# EAGLE design lcd_octopus_t2313_pwm_contrast (EAGLE 6.1)
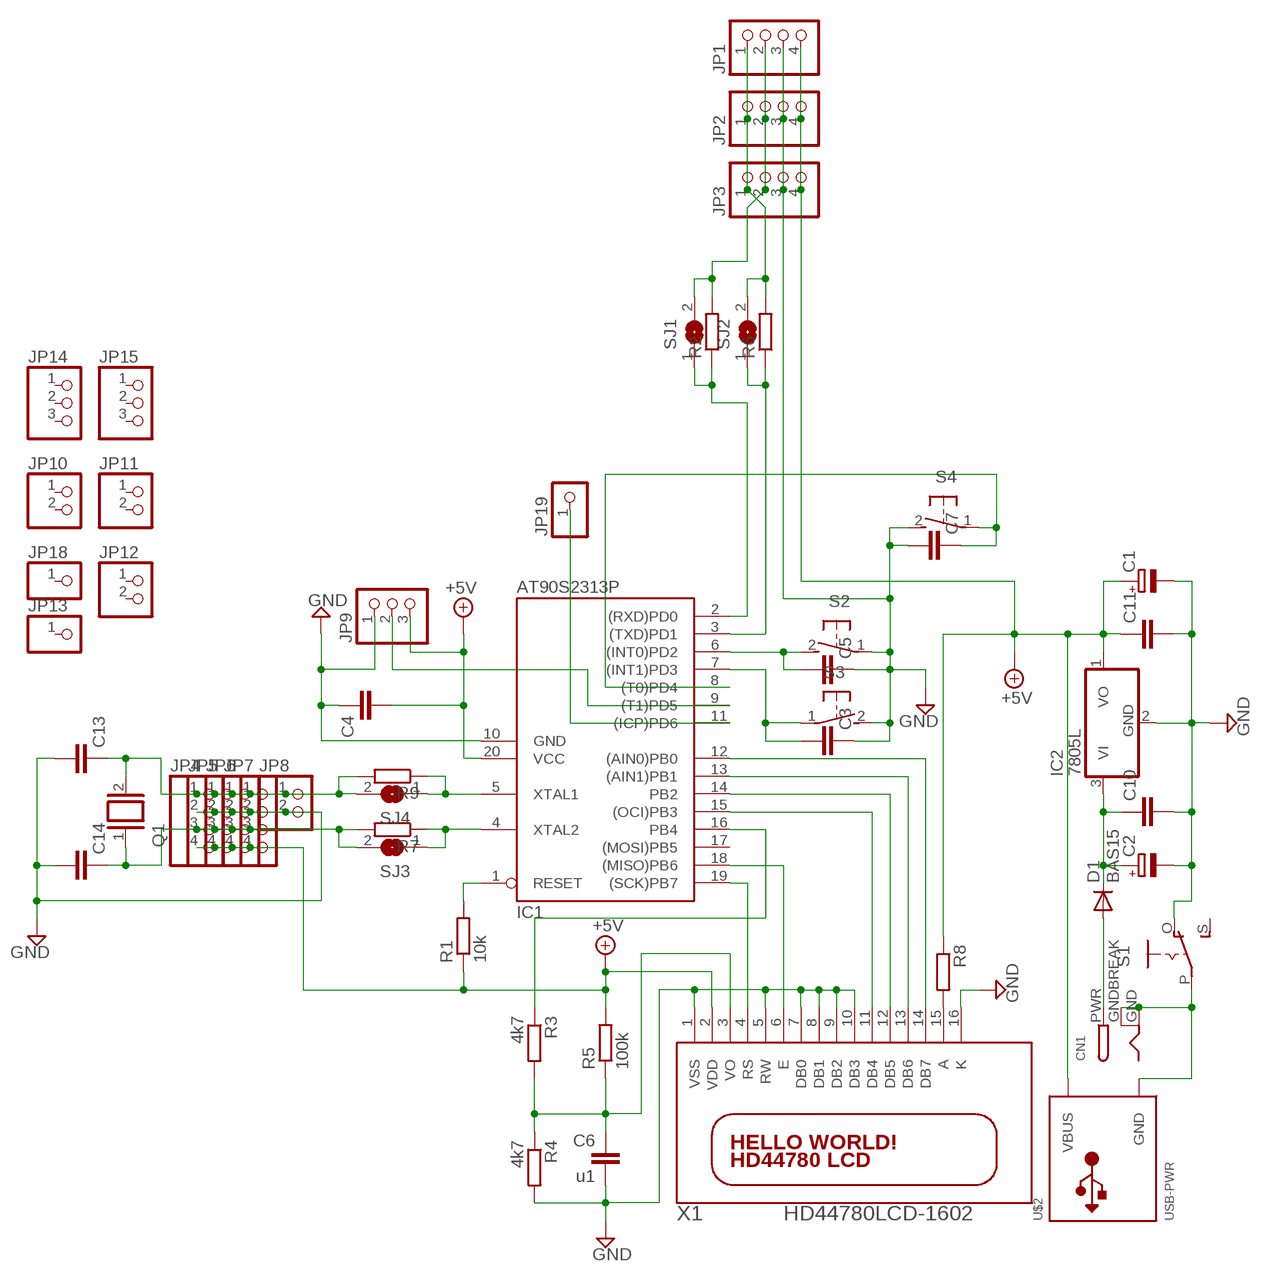
[diagram p0: schematic, sheet 1]

## Parts
C1  CPOL-EUTT2D5L  [TT2D5L]
C2  CPOL-EUTT2D5L  [TT2D5L]
C3  C-EU025-025X050  [C025-025X050]
C4  C-EU025-025X050  [C025-025X050]
C5  C-EU025-025X050  [C025-025X050]
C6  u1  C-EU025-025X050  [C025-025X050]
C7  C-EU025-025X050  [C025-025X050]
C10  C-EU025-025X050  [C025-025X050]
C11  C-EU025-025X050  [C025-025X050]
C13  C-EU025-025X050  [C025-025X050]
C14  C-EU025-025X050  [C025-025X050]
CN1  DCBARRELPTH  [DCJACK_2MM_PTH]
D1  BAS15  [DO34-7]
IC1  AT90S2313P  [DIL20]
IC2  7805L  [TO92]
JP1  PINHD-1X4/90  [1X04/90]
JP2  PINHD-1X4  [1X04]
JP3  PINHD-1X4  [1X04]
JP4  PINHD-1X4  [1X04]
JP5  PINHD-1X4  [1X04]
JP6  PINHD-1X4  [1X04]
JP7  PINHD-1X4  [1X04]
JP8  PINHD-1X2  [1X02]
JP9  PINHD-1X3  [1X03]
JP10  PINHD-1X2  [1X02]
JP11  PINHD-1X2  [1X02]
JP12  PINHD-1X2  [1X02]
JP13  PINHD-1X1  [1X01]
JP14  PINHD-1X3  [1X03]
JP15  PINHD-1X3  [1X03]
JP18  PINHD-1X1  [1X01]
JP19  PINHD-1X1  [1X01]
Q1  XTAL/S  [QS]
R1  10k  R-EU_0204/7  [0204/7]
R2  R-EU_0204/7  [0204/7]
R3  4k7  R-EU_0207/12  [0207/12]
R4  4k7  R-EU_0204/7  [0204/7]
R5  100k  R-EU_0204/7  [0204/7]
R6  R-EU_0204/7  [0204/7]
R7  R-EU_0204/7  [0204/7]
R8  R-EU_0204/7  [0204/7]
R9  R-EU_0204/7  [0204/7]
S1  EG1218S  [EG1218]
S2  31-XX  [B3F-31XX]
S3  31-XX  [B3F-31XX]
S4  31-XX  [B3F-31XX]
SJ1  SJ  [SJ]
SJ2  SJ  [SJ]
SJ3  SJ  [SJ]
SJ4  SJ  [SJ]
U$2  USB-PWR  [USB-MINIB-THM-MOLEX-PWRONLY]
X1  HD44780LCD-1602  [LCD1602]

## Nets
+5V: C1.+ C4.2 C11.1 IC1.20(VCC) IC2.1(VO) JP1.4 JP2.4 JP3.4 JP4.4 JP5.4 JP6.4 JP7.4 JP9.3 R1.1 R5.2 R8.1 U$2.VBUS X1.2(VDD)
EN: IC1.18((MISO)PB6) X1.6(E)
GND: C1.- C2.- C3.1 C4.1 C5.1 C6.2 C7.2 C10.2 C11.2 C13.2 C14.2 IC1.10(GND) IC2.2(GND) JP1.3 JP2.3 JP3.3 JP4.2 JP5.2 JP6.2 JP7.2 JP8.2 JP9.1 R4.2 S1.O S2.1(P) S3.2(S) S4.2(S) X1.1(VSS) X1.5(RW) X1.7(DB0) X1.8(DB1) X1.9(DB2) X1.10(DB3) X1.16(K)
N$1: C2.+ C10.1 D1.C IC2.3(VI)
N$2: IC1.19((SCK)PB7) X1.4(RS)
N$3: IC1.15((OCI)PB3) X1.11(DB4)
N$4: IC1.14(PB2) X1.12(DB5)
N$5: R8.2 X1.15(A)
N$6: IC1.13((AIN1)PB1) X1.13(DB6)
N$7: IC1.12((AIN0)PB0) X1.14(DB7)
N$8: C6.1 R3.2 R4.1 R5.1 X1.3(VO)
N$9: IC1.1(RESET) R1.2
N$10: C3.2 IC1.7((INT1)PD3) S3.1(P)
N$11: IC1.9((T1)PD5) JP9.2
N$12: C5.2 IC1.6((INT0)PD2) S2.2(S)
N$13: C14.1 JP4.3 JP5.3 JP6.3 JP7.3 Q1.1 R7.2 SJ3.2
N$14: CN1.PWR D1.A
N$15: IC1.16(PB4) R3.1
N$16: IC1.3((TXD)PD1) R6.1 SJ2.1
N$17: CN1.GND CN1.GNDBREAK S1.P U$2.GND
N$18: IC1.2((RXD)PD0) R2.1 SJ1.1
N$19: IC1.4(XTAL2) R7.1 SJ3.1
N$20: C7.1 IC1.8((T0)PD4) S4.1(P)
N$21: IC1.11((ICP)PD6) JP19.1
N$22: JP1.2 JP2.2 JP3.2 R2.2 SJ1.2
N$23: JP1.1 JP2.1 JP3.1 R6.2 SJ2.2
N$24: C13.1 JP4.1 JP5.1 JP6.1 JP7.1 JP8.1 Q1.2 R9.2 SJ4.2
N$25: IC1.5(XTAL1) R9.1 SJ4.1
Unconnected: IC1.17((MOSI)PB5) JP10.1 JP10.2 JP11.1 JP11.2 JP12.1 JP12.2 JP13.1 JP14.1 JP14.2 JP14.3 JP15.1 JP15.2 JP15.3 JP18.1 S1.S

## Library data of the parts
C1 C2 = rcl:CPOL-EU: POLARIZED CAPACITOR, European symbol
C3-C7 C10 C11 C13 C14 = rcl:C-EU: CAPACITOR, European symbol
CN1 = adafruit:DCBARREL: 2.0mm DC Barrel Jack DCJACK_2MM_PTH - Through Hole Jack (4UConnector: 05537)
D1 = diode:BAS15: DIODE high speed
IC1 = atmel:AT90S2313: MICROCONTROLLER 2 Kbytes FLASH 128 bytes SRAM 128 bytes EEPROM UART; OC_FARNELL: unknown; OC_NEWARK: unknown
IC2 = linear:78*: Positive VOLTAGE REGULATOR Source: http://cache.national.com/ds/LM/LM78L05.pdf http://www.fairchildsemi.com/ds/LM/LM7805.pdf
JP1-JP7 = pinhead:PINHD-1X4: PIN HEADER
JP8 JP10-JP12 = pinhead:PINHD-1X2: PIN HEADER
JP9 JP14 JP15 = pinhead:PINHD-1X3: PIN HEADER
JP13 JP18 JP19 = pinhead:PINHD-1X1: PIN HEADER
Q1 = special:XTAL/S: CRYSTAL
R1-R9 = rcl:R-EU_: RESISTOR, European symbol
S1 = adafruit:EG1218: SLIDING SWITCH 0.1" spacing through hole, vertical SPDT slide switch http://www.ladyada.net/library/pcb/eaglelibrary.html
S2-S4 = adafruit:31-XX: OMRON SWITCH Now with beefier pads!
SJ1-SJ4 = jumper:SJ: SMD solder JUMPER
U$2 = adafruit:USB-PWR
X1 = adafruit:HD44780LCD: HD44780 LCD Standard character type LCDs, available in sizes from 8x1 to 40x4!

## Board
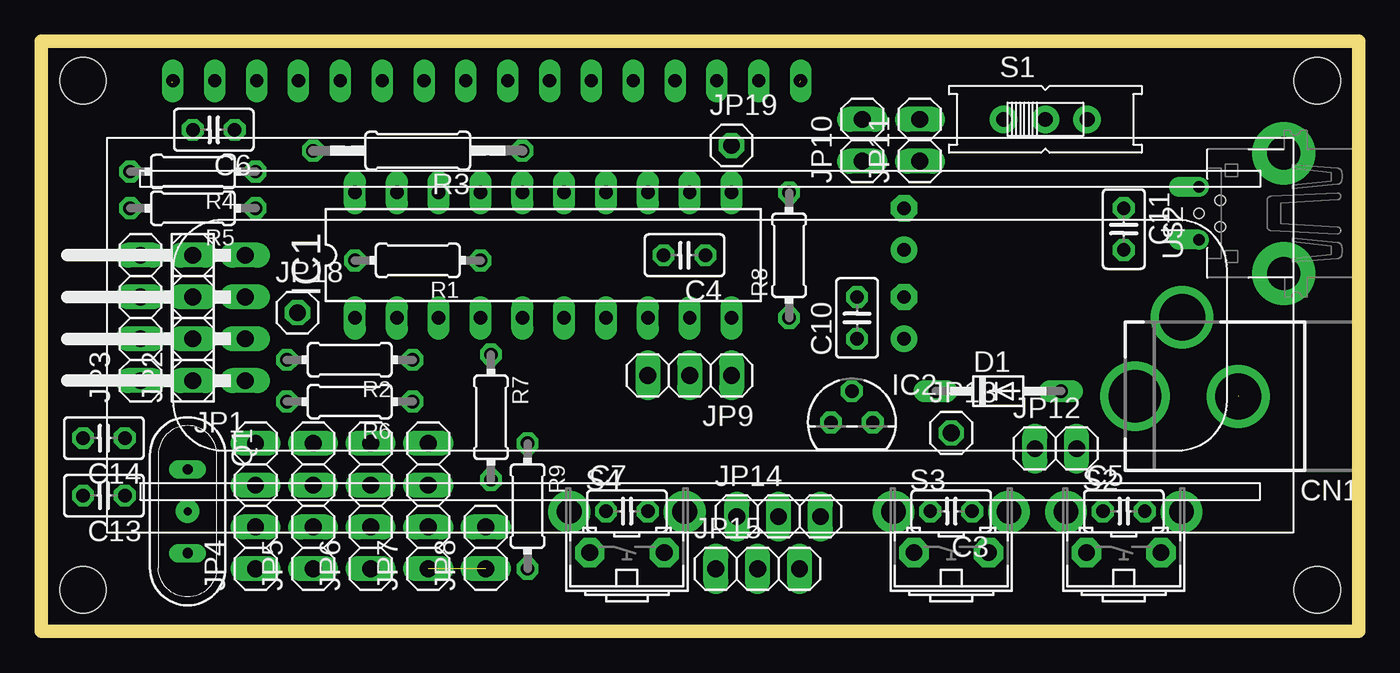
[diagram p1: board, top side]
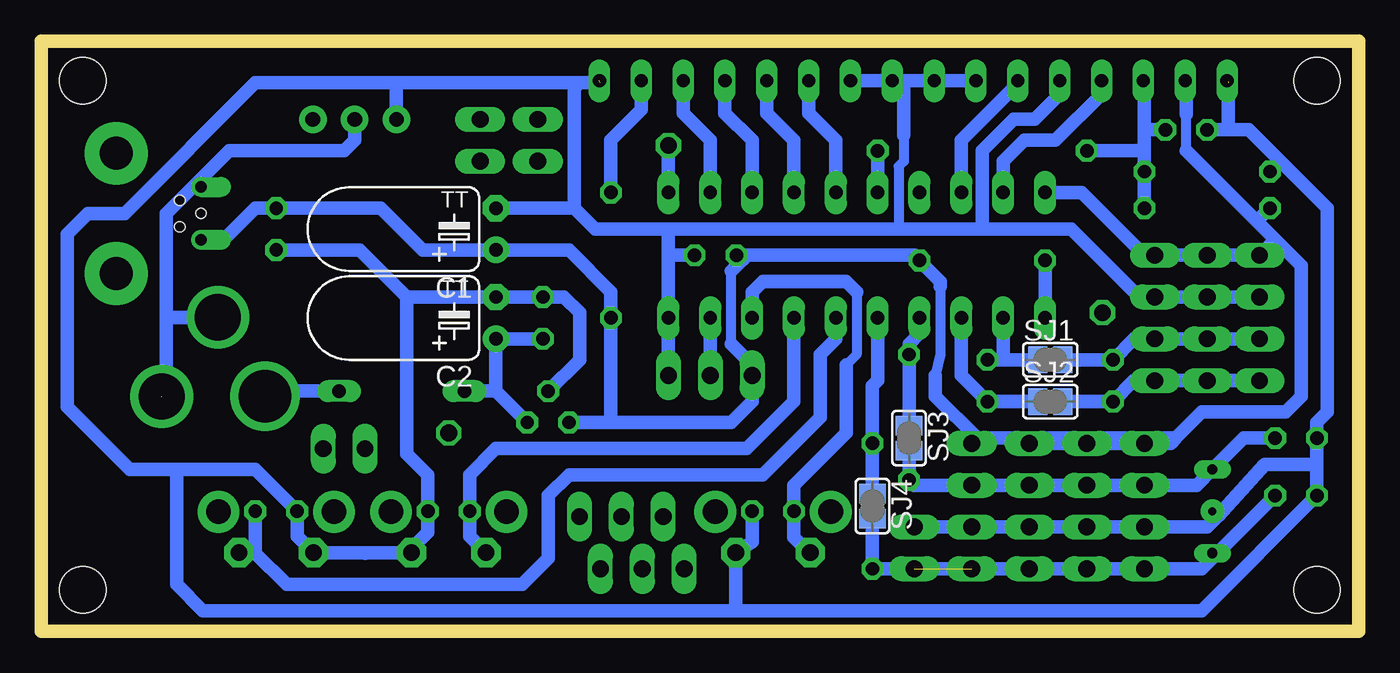
[diagram p2: board, bottom side, seen from below]

Size 79.99 x 35.87 mm. Coordinates in mm from the lower left corner, seen from the top.
Outline: 0,0 79.99,0 79.99,35.87 0,35.87 0,0
Copper layers (1*16): Top 0.035mm / dielectric 1.5mm / Bottom 0.035mm
Design rules: minimum track width 10mil, minimum drill 24mil, track to track 8mil, track to pad 8mil, pad to pad 8mil, via to via 8mil, smd to smd 8mil, copper to edge 40mil, drill to drill 8mil, minimum pad ring 10mil, minimum via ring 8mil, stop-mask expansion 4mil, vias tented up to drill 0mil, thermal gap 10mil

### Footprints (pad centres in the part's own frame; a part is rotated, then mirrored left to right if it is on the bottom)
TT2D5L = drill 0.813 pad 1.6: + -1.27,0 | drill 0.813 pad 1.6 octagon: - 1.27,0
C025-025X050 = drill 0.813 octagon: 1 -1.27,0; 2 1.27,0
DCJACK_2MM_PTH = drill 2.8: GND 0,7.35; GNDBREAK 4.8,10.75 | drill 3.2: PWR 0,13.6
DO34-7 = drill 0.813 long: A 3.81,0; C -3.81,0
DIL20 = drill 0.813 long: 1 -11.43,-3.81; 2 -8.89,-3.81; 3 -6.35,-3.81; 4 -3.81,-3.81; 5 -1.27,-3.81; 6 1.27,-3.81; 7 3.81,-3.81; 8 6.35,-3.81; 9 8.89,-3.81; 10 11.43,-3.81; 11 11.43,3.81; 12 8.89,3.81; 13 6.35,3.81; 14 3.81,3.81; 15 1.27,3.81; 16 -1.27,3.81; 17 -3.81,3.81; 18 -6.35,3.81; 19 -8.89,3.81; 20 -11.43,3.81
TO92 = drill 0.813 octagon: 1 -1.27,0; 2 0,1.905; 3 1.27,0
1X04/90 = drill 1.016 long: 1 -3.81,-3.81; 2 -1.27,-3.81; 3 1.27,-3.81; 4 3.81,-3.81
1X04 = drill 1.016 long: 1 -3.81,0; 2 -1.27,0; 3 1.27,0; 4 3.81,0
1X02 = drill 1.016 long: 1 -1.27,0; 2 1.27,0
1X03 = drill 1.016 long: 1 -2.54,0; 2 0,0; 3 2.54,0
1X01 = drill 1.016 octagon: 1 0,0
QS = drill 0.61 long: 1 -2.54,0; 2 2.54,0
0204/7 = drill 0.813 octagon: 1 -3.81,0; 2 3.81,0
0207/12 = drill 0.813 octagon: 1 -6.35,0; 2 6.35,0
EG1218 = drill 0.9 pad 1.676: O -2.54,0; P 0,0; S 2.54,0
B3F-31XX = drill 1.016 pad 1.778 octagon: 1 -2.261,-1.245; 2 2.261,-1.245 | drill 1.499 pad 2.54: 3 -3.505,1.245; 4 3.505,1.245
SJ = smd 1.168 x 1.6: 1 -0.762,0; 2 0.762,0
USB-MINIB-THM-MOLEX-PWRONLY = drill 0.7 offset: GND 1.6,4.64; VBUS -1.6,4.64 | drill 2 pad 3.81: GND1 -3.65,-0.51; GND4 3.65,-0.51 | hole 0.6: 0,4.648; 0.787,3.353; -0.813,3.353
LCD1602 = drill 0.8 long: 1 8,33.46; 2 10.54,33.46; 3 13.08,33.46; 4 15.62,33.46; 5 18.16,33.46; 6 20.7,33.46; 7 23.24,33.46; 8 25.78,33.46; 9 28.32,33.46; 10 30.86,33.46; 11 33.4,33.46; 12 35.94,33.46; 13 38.48,33.46; 14 41.02,33.46; 15 43.56,33.46; 16 46.1,33.46 | hole 2.8: 2.54,2.54; 2.54,33.46; 77.46,33.46; 77.46,2.54

### Placement (x,y rotation side)
C1  52.39,24.45 90 bottom
C2  52.39,19.05 90 bottom
C3  55.24,7.3 180 top
C4  39.05,22.86 180 top
C5  65.72,7.3 0 top
C6  10.48,30.48 180 top
C7  35.56,7.3 0 top
C10  49.53,19.05 90 top
C11  65.72,24.45 270 top
C13  3.81,8.26 180 top
C14  3.81,11.75 180 top
CN1  80.01,14.29 90 top
D1  58.1,14.61 0 top
IC1  30.48,22.86 0 top
IC2  49.21,12.7 0 top
JP1  8.57,19.05 90 top
JP2  9.21,19.05 90 top
JP3  6.03,19.05 90 top
JP4  13.02,7.62 90 top
JP5  16.51,7.62 90 top
JP6  20,7.62 90 top
JP7  23.5,7.62 90 top
JP8  26.99,5.08 90 top
JP9  39.37,15.56 180 top
JP10  49.85,29.84 90 top
JP11  53.34,29.84 90 top
JP12  61.59,11.11 0 top
JP13  55.24,12.06 0 top
JP14  44.77,6.99 0 top
JP15  43.5,3.81 0 top
JP18  15.56,19.37 0 top
JP19  41.91,29.53 0 top
Q1  8.89,7.3 270 top
R1  22.86,22.54 180 top
R2  18.73,16.51 180 top
R3  22.86,29.21 180 top
R4  9.21,27.94 180 top
R5  9.21,25.72 180 top
R6  18.73,13.97 180 top
R7  27.3,13.02 270 top
R8  45.4,22.86 90 top
R9  29.53,7.62 270 top
S1  60.96,31.11 0 top
S2  65.72,6.03 0 top
S3  55.24,6.03 0 top
S4  35.56,6.03 0 top
SJ1  18.73,16.51 0 bottom
SJ2  18.73,13.97 0 bottom
SJ3  27.3,11.75 270 bottom
SJ4  29.53,7.62 270 bottom
U$2  74.93,25.4 90 top
X1  0,0 0 top

### Tracks (layer width: path | path; a pad name or v marks a point on that pad's centre or on a via)
+5V
  Bottom 0.61: 38.1,17.46 38.1,21.91 | 25.4,20.95 25.4,16.83 25.72,15.56 | 10.48,29.21 10.48,31.43
  Bottom 0.813: U$2.VBUS 70.28,23.81 68.9,23.81 66.99,25.72 C11.1 59.37,25.72 56.83,23.18 C1.+ 47.94,23.18 45.4,20.64 R8.1 45.4,12.7 | 37.47,22.54 37.15,22.86 26.99,22.86 R1.1 25.4,21.27 25.4,20.95 | 37.47,22.54 38.1,21.91 | 5.08,23.81 3.49,22.23 3.49,14.29 4.45,13.34 9.53,13.34 11.11,11.75 | 5.08,23.81 6.19,24.92 | 6.19,24.92 10.48,29.21 | R5.2 6.19,24.92 | 5.08,23.81 JP3.4 JP2.4 JP1.4 13.02,22.86 16.83,26.67 IC1.20 | 25.72,15.56 25.72,14.29 23.18,11.75 | 23.18,11.75 11.11,11.75 | JP6.4 JP5.4 JP4.4 11.43,11.43 11.11,11.75 | JP7.4 23.18,11.75 | 38.1,17.46 36.83,16.19 JP9.3 36.83,13.97 38.1,12.7 45.4,12.7 | 45.4,12.7 IC2.1 | 10.48,31.43 10.48,33.4 X1.2 | C4.2 37.47,22.54
EN
  Bottom 0.813: IC1.18 24.13,29.84 20.7,33.27 X1.6
GND  (via drill 0.5 pad 1.42)  (2 unrouted)
  Bottom 0.61: 27.62,30.16 27.62,28.57 27.94,28.26 27.94,24.77 27.62,24.45
  Bottom 0.813: 22.86,24.45 22.86,29.21 20.95,31.11 19.68,31.11 18.16,32.64 X1.5 | S3.2 S2.1 | S2.1 63.79,4.79 63.82,4.76 | S3.2 60.3,4.79 60.33,4.76 | S3.2 60.33,4.79 | 57.76,4.79 56.52,6.03 C3.1 56.52,9.53 57.78,10.79 57.78,20.32 | S2.1 64.45,5.78 C5.1 66.99,9.84 71.75,9.84 | X1.9 X1.10 | X1.7 X1.8 X1.9 | 41.91,24.45 27.62,24.45 22.86,24.45 | 41.91,22.86 IC1.10 JP9.1 | 41.91,22.86 41.91,24.45 | 47.62,25.72 47.62,33.02 47.31,33.34 | 58.42,33.34 66.99,33.34 74.93,25.4 77.15,25.4 78.42,24.13 78.42,13.65 74.61,9.84 71.75,9.84 | 58.42,33.34 47.31,33.34 | 47.31,33.34 46.04,33.34 | S3.2 57.76,4.79 | 57.76,4.79 57.78,4.76 | S1.O 58.42,33.34 | 41.91,24.45 46.35,24.45 47.62,25.72 | 47.62,25.72 C1.- | 71.75,9.84 71.75,2.86 70.17,1.27 38.42,1.27 | 7.94,33.4 X1.1 | C11.2 60.64,23.18 57.78,20.32 | 57.78,20.32 C2.- C10.2 48.26,20.32 47.31,19.37 47.31,16.51 IC2.2 | X1.9 27.75,33.46 27.62,33.34 27.62,30.16 | 38.42,1.27 37.82,1.31 S4.2 36.83,5.46 C7.2 | JP3.3 JP2.3 JP1.3 13.34,20.32 17.46,24.45 22.86,24.45 | 8.57,6.99 9.21,6.35 JP4.2 JP5.2 JP6.2 JP7.2 JP8.2 | 8.57,6.99 5.71,10.16 2.54,10.16 | v8.89,7.3 8.57,6.99 | 2.54,10.16 C14.2 2.54,12.7 1.91,13.34 1.91,25.72 4.76,28.57 | 38.42,1.27 9.53,1.27 C13.2 2.54,10.16 | R4.2 4.76,28.57 | 4.76,28.57 6.67,30.48 7.94,30.48 | 7.94,30.48 C6.2 | 7.94,33.34 7.94,30.48 | C4.1 41.91,22.86
N$1
  Bottom 0.813: C10.1 C2.+ 52.39,14.61 | IC2.3 52.39,14.61 | D1.C 52.39,14.61
N$2
  Bottom 0.813: X1.4 15.62,32.64 18.41,29.84 20.32,29.84 21.59,28.57 IC1.19
N$3
  Bottom 0.813: X1.11 33.4,31.5 31.75,29.84 IC1.15
N$4
  Bottom 0.813: X1.12 35.94,31.5 34.29,29.84 IC1.14
N$5
  Bottom 0.813: X1.15 43.56,31.69 45.4,29.84 R8.2
N$6
  Bottom 0.813: X1.13 38.48,31.5 36.83,29.84 IC1.13
N$7
  Bottom 0.813: X1.14 41.02,31.5 39.37,29.84 IC1.12
N$8
  Bottom 0.813: R5.1 R4.1 13.02,29.21 | X1.3 13.08,33.4 13.02,33.34 13.02,30.48 | 13.02,30.48 13.02,29.21 | C6.1 13.02,30.48 | R3.2 13.02,29.21
N$9
  Bottom 0.813: IC1.1 R1.2
N$10
  Bottom 0.61: 52.96,4.76 53.02,4.76 53.98,5.71
  Bottom 0.813: 52.96,4.76 S3.1 53.98,5.78 C3.2 53.98,9.53 52.39,11.11 37.15,11.11 34.29,13.97 IC1.7
N$11
  Bottom 0.813: JP9.2 IC1.9
N$12
  Bottom 0.813: 66.99,4.76 67.63,4.76 | 67.63,4.76 68.26,4.76 | S2.2 67.65,4.79 67.63,4.76 | C5.2 66.99,4.76 | 66.99,4.76 65.09,2.86 50.8,2.86 49.21,4.45 49.21,8.26 47.94,9.53 36.2,9.53 32.7,13.02 32.7,16.83 31.75,17.78 IC1.6
N$13
  Bottom 0.813: C14.1 6.99,11.75 Q1.1 9.84,8.89 JP4.3 JP5.3 JP6.3 JP7.3 26.99,8.89 R7.2 SJ3.2
N$14
  Bottom 0.813: D1.A 66.09,14.61 CN1.PWR
N$15
  Bottom 0.813: IC1.16 R3.1
N$16
  Bottom 0.813: SJ2.1 R6.1 24.13,15.56 IC1.3
N$17  (1 unrouted)
  Bottom 0.813: S1.P 60.96,29.84 61.59,29.21 68.58,29.21 70.79,27 | 70.79,27 72.39,25.4 72.39,19.05 | U$2.GND 70.79,27 | 72.39,19.05 72.39,14.61 72.71,14.29 | CN1.GNDBREAK 72.35,19.09 72.39,19.05
N$18
  Bottom 0.813: SJ1.1 21.59,16.51 | 21.59,16.51 R2.1 | IC1.2 21.59,16.51
N$19
  Bottom 0.813: SJ3.1 R7.1 27.3,17.46 26.67,18.1 IC1.4
N$20
  Bottom 0.61: 30.48,20.64 30.48,16.83 31.11,16.19
  Bottom 0.813: S4.1 33.36,4.79 34.29,5.71 C7.1 34.29,8.89 31.11,12.06 31.11,16.19 | IC1.8 36.83,20.64 36.2,21.27 31.11,21.27 30.48,20.64
N$21
  Bottom 0.813: IC1.11 JP19.1
N$22
  Bottom 0.813: JP3.2 JP2.2 JP1.2 13.65,17.78 R2.2 SJ1.2
N$23
  Bottom 0.813: JP3.1 JP2.1 JP1.1 13.65,15.24 R6.2 SJ2.2
N$24  (1 unrouted)
  Bottom 0.813: SJ4.2 R9.2 JP8.1 JP6.1 JP5.1 JP4.1 9.53,3.81 8.73,4.6 | 8.73,4.6 C13.1 | Q1.2 8.73,4.6
N$25
  Bottom 0.813: 29.53,3.81 SJ4.1 R9.1 29.53,14.92 29.21,15.24 IC1.5